# Altium schematic sheet Sheet7_Mecânica.SchDoc
size A4; SheetNumber: 7; SheetTotal: 7
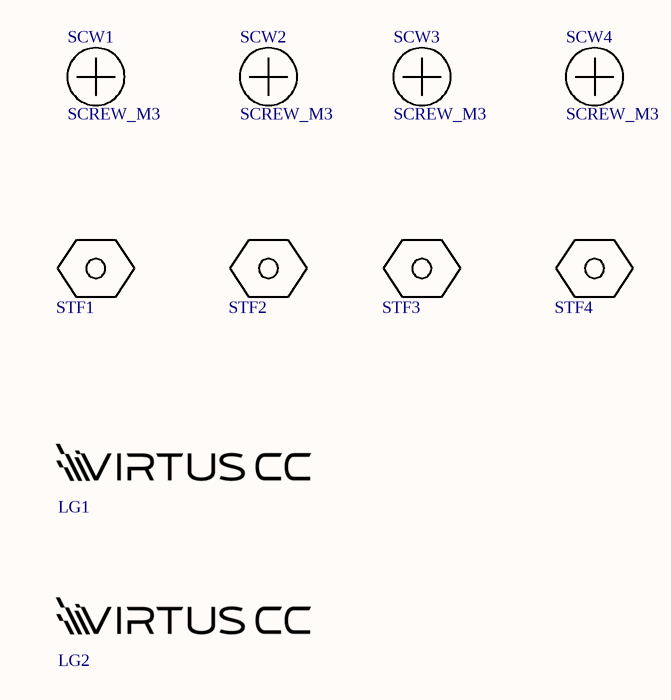
[diagram p0: Sheet7_Mecânica.SchDoc]

## Parts
?  (no value)  (graphical)
LG1  Logo_Virtus  [Logo_VirtusCC]  (value not drawn)
LG2  Logo_Virtus  [Logo_VirtusCC]  (value not drawn)
SCW1  SCREW_M3  [SCREWM3]
SCW2  SCREW_M3  [SCREWM3]
SCW3  SCREW_M3  [SCREWM3]
SCW4  SCREW_M3  [SCREWM3]
STF1  R30-1011502  [R30-1011502]  (value not drawn)
STF2  R30-1011502  [R30-1011502]  (value not drawn)
STF3  R30-1011502  [R30-1011502]  (value not drawn)
STF4  R30-1011502  [R30-1011502]  (value not drawn)

## Notes on the sheet
- Título:
- Endereço:
- Rua Aprígio Veloso, 1500 - Bodocongó
  CEP: 58429-140
  Campina Grande, Paraíba
  Brasil
- Type @ to refer to a designator
- Projeto:
- Conta:
- Projetista:
- Arquivo:
- Data:
- Revisor:
- Pág.:
- Rev.:
- de

## Library data of the parts
? = Title Block
STF1-STF4 = R30-1011502: HEX STANDOFF M3x0.5 BRASS 15MM